# Altium schematic sheet Zynq power and decoupling.SchDoc
size A3; SheetNumber: 3; SheetTotal: 11
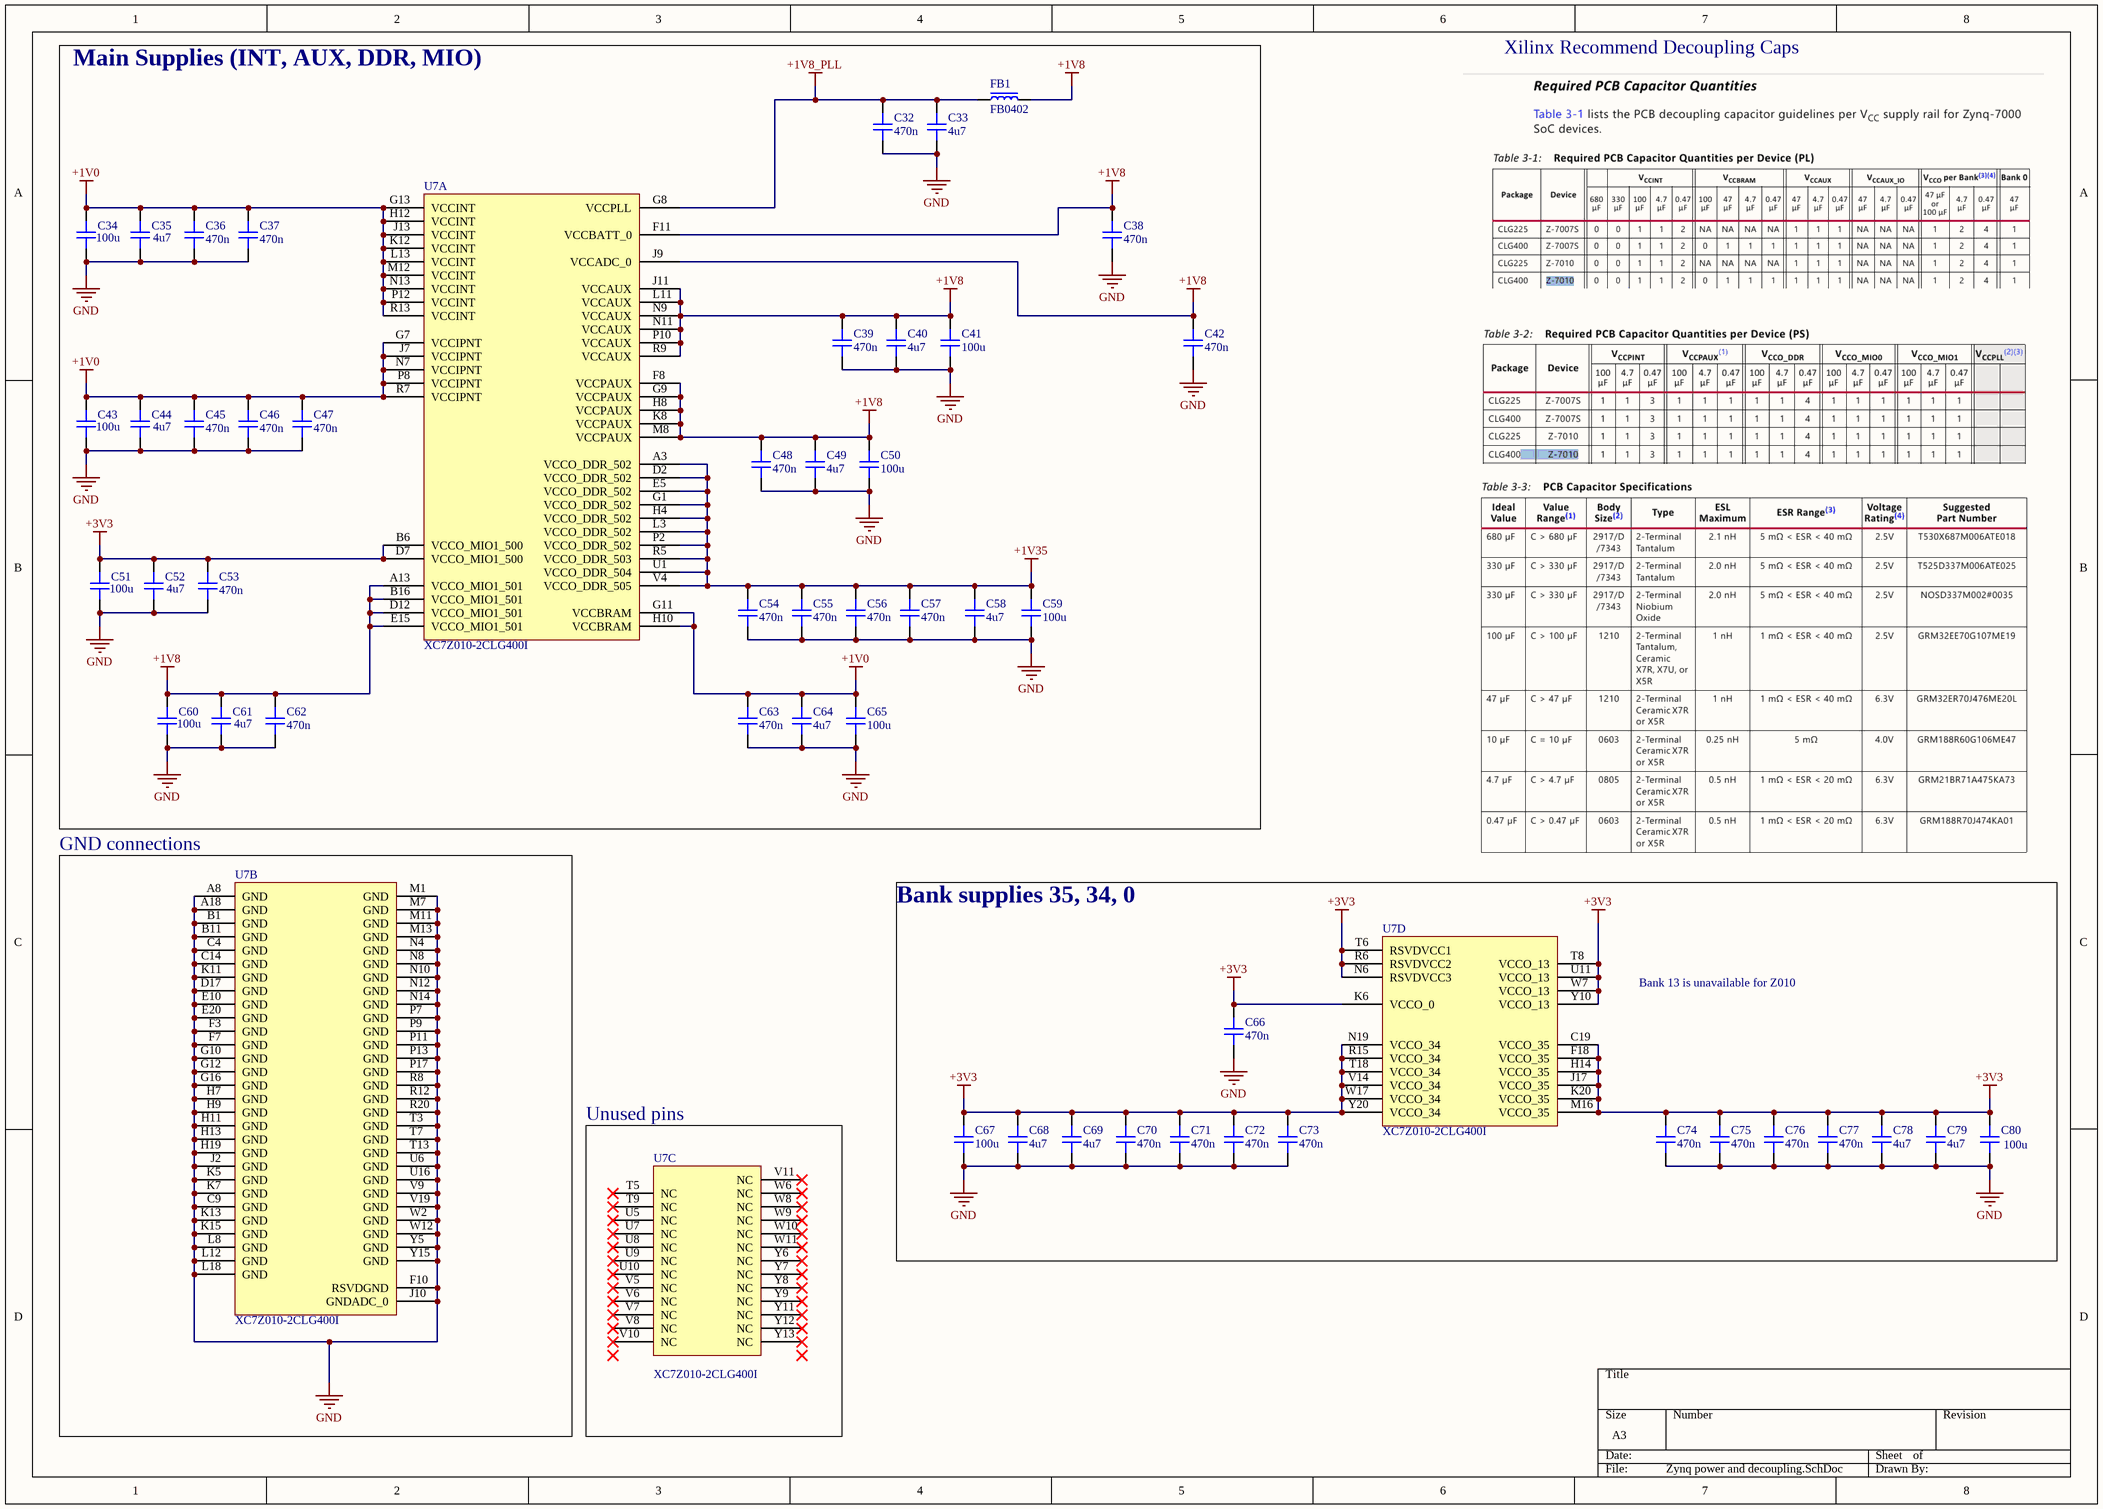
[diagram p0: Zynq power and decoupling.SchDoc]

## Parts
C32  value 470n  [CAP_0201]  (hidden comment: C0201)
C33  value 4u7  [CAP_0402]  (hidden comment: C0402)
C34  value 100u  [CAP_1210]  (hidden comment: C1210)
C35  value 4u7  [CAP_0402]  (hidden comment: C0402)
C36  value 470n  [CAP_0201]  (hidden comment: C0201)
C37  value 470n  [CAP_0201]  (hidden comment: C0201)
C38  value 470n  [CAP_0201]  (hidden comment: C0201)
C39  value 470n  [CAP_0201]  (hidden comment: C0201)
C40  value 4u7  [CAP_0402]  (hidden comment: C0402)
C41  value 100u  [CAP_1210]  (hidden comment: C1210)
C42  value 470n  [CAP_0201]  (hidden comment: C0201)
C43  value 100u  [CAP_1210]  (hidden comment: C1210)
C44  value 4u7  [CAP_0402]  (hidden comment: C0402)
C45  value 470n  [CAP_0201]  (hidden comment: C0201)
C46  value 470n  [CAP_0201]  (hidden comment: C0201)
C47  value 470n  [CAP_0201]  (hidden comment: C0201)
C48  value 470n  [CAP_0201]  (hidden comment: C0201)
C49  value 4u7  [CAP_0402]  (hidden comment: C0402)
C50  value 100u  [CAP_1210]  (hidden comment: C1210)
C51  value 100u  [CAP_1210]  (hidden comment: C1210)
C52  value 4u7  [CAP_0402]  (hidden comment: C0402)
C53  value 470n  [CAP_0201]  (hidden comment: C0201)
C54  value 470n  [CAP_0201]  (hidden comment: C0201)
C55  value 470n  [CAP_0201]  (hidden comment: C0201)
C56  value 470n  [CAP_0201]  (hidden comment: C0201)
C57  value 470n  [CAP_0201]  (hidden comment: C0201)
C58  value 4u7  [CAP_0402]  (hidden comment: C0402)
C59  value 100u  [CAP_1210]  (hidden comment: C1210)
C60  value 100u  [CAP_1210]  (hidden comment: C1210)
C61  value 4u7  [CAP_0402]  (hidden comment: C0402)
C62  value 470n  [CAP_0201]  (hidden comment: C0201)
C63  value 470n  [CAP_0201]  (hidden comment: C0201)
C64  value 4u7  [CAP_0402]  (hidden comment: C0402)
C65  value 100u  [CAP_1210]  (hidden comment: C1210)
C66  value 470n  [CAP_0201]  (hidden comment: C0201)
C67  value 100u  [CAP_1210]  (hidden comment: C1210)
C68  value 4u7  [CAP_0402]  (hidden comment: C0402)
C69  value 4u7  [CAP_0402]  (hidden comment: C0402)
C70  value 470n  [CAP_0201]  (hidden comment: C0201)
C71  value 470n  [CAP_0201]  (hidden comment: C0201)
C72  value 470n  [CAP_0201]  (hidden comment: C0201)
C73  value 470n  [CAP_0201]  (hidden comment: C0201)
C74  value 470n  [CAP_0201]  (hidden comment: C0201)
C75  value 470n  [CAP_0201]  (hidden comment: C0201)
C76  value 470n  [CAP_0201]  (hidden comment: C0201)
C77  value 470n  [CAP_0201]  (hidden comment: C0201)
C78  value 4u7  [CAP_0402]  (hidden comment: C0402)
C79  value 4u7  [CAP_0402]  (hidden comment: C0402)
C80  value 100u  [CAP_1210]  (hidden comment: C1210)
FB1  FB0402  [FB_0402]
U7  XC7Z010-2CLG400I  [BGA400C80P20X20_1700X1700X160N]  (parts A,B,C,D of 9)

## Blocks framed on the sheet
Main Supplies (INT, AUX, DDR, MIO): C32-C65 FB1 U7
GND connections: U7
Bank supplies 35, 34, 0: C66-C80 U7
Unused pins: U7

## Nets
+1V0: C34.2 C35.2 C36.2 C37.2 C43.2 C44.2 C45.2 C46.2 C47.2 C63.2 C64.2 C65.2 U7.G7(VCCIPNT) U7.G11(VCCBRAM) U7.G13(VCCINT) U7.H10(VCCBRAM) U7.H12(VCCINT) U7.J7(VCCIPNT) U7.J13(VCCINT) U7.K12(VCCINT) U7.L13(VCCINT) U7.M12(VCCINT) U7.N7(VCCIPNT) U7.N13(VCCINT) U7.P8(VCCIPNT) U7.P12(VCCINT) U7.R7(VCCIPNT) U7.R13(VCCINT)
+1V8: C38.2 C39.2 C40.2 C41.2 C42.2 C48.2 C49.2 C50.2 C60.2 C61.2 C62.2 FB1.2 U7.A13(VCCO_MIO1_501) U7.B16(VCCO_MIO1_501) U7.D12(VCCO_MIO1_501) U7.E15(VCCO_MIO1_501) U7.F8(VCCPAUX) U7.F11(VCCBATT_0) U7.G9(VCCPAUX) U7.H8(VCCPAUX) U7.J9(VCCADC_0) U7.J11(VCCAUX) U7.K8(VCCPAUX) U7.L11(VCCAUX) U7.M8(VCCPAUX) U7.N9(VCCAUX) U7.N11(VCCAUX) U7.P10(VCCAUX) U7.R9(VCCAUX)
+1V8_PLL: C32.2 C33.2 FB1.1 U7.G8(VCCPLL)
+1V35: C54.2 C55.2 C56.2 C57.2 C58.2 C59.2 U7.A3(VCCO_DDR_502) U7.D2(VCCO_DDR_502) U7.E5(VCCO_DDR_502) U7.G1(VCCO_DDR_502) U7.H4(VCCO_DDR_502) U7.L3(VCCO_DDR_502) U7.P2(VCCO_DDR_502) U7.R5(VCCO_DDR_503) U7.U1(VCCO_DDR_504) U7.V4(VCCO_DDR_505)
+3V3: C51.2 C52.2 C53.2 C66.2 C67.2 C68.2 C69.2 C70.2 C71.2 C72.2 C73.2 C74.2 C75.2 C76.2 C77.2 C78.2 C79.2 C80.2 U7.B6(VCCO_MIO1_500) U7.C19(VCCO_35) U7.D7(VCCO_MIO1_500) U7.F18(VCCO_35) U7.H14(VCCO_35) U7.J17(VCCO_35) U7.K6(VCCO_0) U7.K20(VCCO_35) U7.M16(VCCO_35) U7.N6(RSVDVCC3) U7.N19(VCCO_34) U7.R6(RSVDVCC2) U7.R15(VCCO_34) U7.T6(RSVDVCC1) U7.T8(VCCO_13) U7.T18(VCCO_34) U7.U11(VCCO_13) U7.V14(VCCO_34) U7.W7(VCCO_13) U7.W17(VCCO_34) U7.Y10(VCCO_13) U7.Y20(VCCO_34)
GND: C32.1 C33.1 C34.1 C35.1 C36.1 C37.1 C38.1 C39.1 C40.1 C41.1 C42.1 C43.1 C44.1 C45.1 C46.1 C47.1 C48.1 C49.1 C50.1 C51.1 C52.1 C53.1 C54.1 C55.1 C56.1 C57.1 C58.1 C59.1 C60.1 C61.1 C62.1 C63.1 C64.1 C65.1 C66.1 C67.1 C68.1 C69.1 C70.1 C71.1 C72.1 C73.1 C74.1 C75.1 C76.1 C77.1 C78.1 C79.1 C80.1 U7.A8(GND) U7.A18(GND) U7.B1(GND) U7.B11(GND) U7.C4(GND) U7.C9(GND) U7.C14(GND) U7.D17(GND) U7.E10(GND) U7.E20(GND) U7.F3(GND) U7.F7(GND) U7.F10(RSVDGND) U7.G10(GND) U7.G12(GND) U7.G16(GND) U7.H7(GND) U7.H9(GND) U7.H11(GND) U7.H13(GND) U7.H19(GND) U7.J2(GND) U7.J10(GNDADC_0) U7.K5(GND) U7.K7(GND) U7.K11(GND) U7.K13(GND) U7.K15(GND) U7.L8(GND) U7.L12(GND) U7.L18(GND) U7.M1(GND) U7.M7(GND) U7.M11(GND) U7.M13(GND) U7.N4(GND) U7.N8(GND) U7.N10(GND) U7.N12(GND) U7.N14(GND) U7.P7(GND) U7.P9(GND) U7.P11(GND) U7.P13(GND) U7.P17(GND) U7.R8(GND) U7.R12(GND) U7.R20(GND) U7.T3(GND) U7.T7(GND) U7.T13(GND) U7.U6(GND) U7.U16(GND) U7.V9(GND) U7.V19(GND) U7.W2(GND) U7.W12(GND) U7.Y5(GND) U7.Y15(GND)

Not connected (* = marked no-connect by the designer): U7 T5(NC)* T9(NC)* U5(NC)* U7(NC)* U8(NC)* U9(NC)* U10(NC)* V5(NC)* V6(NC)* V7(NC)* V8(NC)* V10(NC)* V11(NC)* W6(NC)* W8(NC)* W9(NC)* W10(NC)* W11(NC)* Y6(NC)* Y7(NC)* Y8(NC)* Y9(NC)* Y11(NC)* Y12(NC)* Y13(NC)*

## Notes on the sheet
- Xilinx Recommend Decoupling Caps
- Bank 13 is unavailable for Z010

## Library data of the parts
C32 C36-C39 C42 C45-C48 C53-C57 C62 C63 C66 C70-C77 = CAP_0201: Capacitor SMD 0201; Rating: 16V; Manufacturer: *; Manufacturer Part Number: *; Distributor Link: *; LCSC: *; Dielectric: *
C33 C35 C40 C44 C49 C52 C58 C61 C64 C68 C69 C78 C79 = CAP_0402: Capacitor SMD 0402; Manufacturer: *; Manufacturer Part Number: *; Distributor Link: *; LCSC: *; Rating: *; Dielectric: *
C34 C41 C43 C50 C51 C59 C60 C65 C67 C80 = CAP_1210: Capacitor SMD 1210; Manufacturer: *; Manufacturer Part Number: *; Distributor Link: *; LCSC: *; Rating: *; Dielectric: *
FB1 = FB_0402: Ferrite Bead SMD 0402; Manufacturer: *; Manufacturer Part Number: *; Distributor Link: *; LCSC: *